# EasyEDA Pro project ax08_doc.eprj, schematic sequencer
Board Name: sequencer; Create Date: 2025-08-25; Page Name: sequencer; Project Name: ax08; Schematic Name: sequencer; Update Date: 2025-08-25; Company: EasyEDA.com; Page Size: A4; Version: V1.0
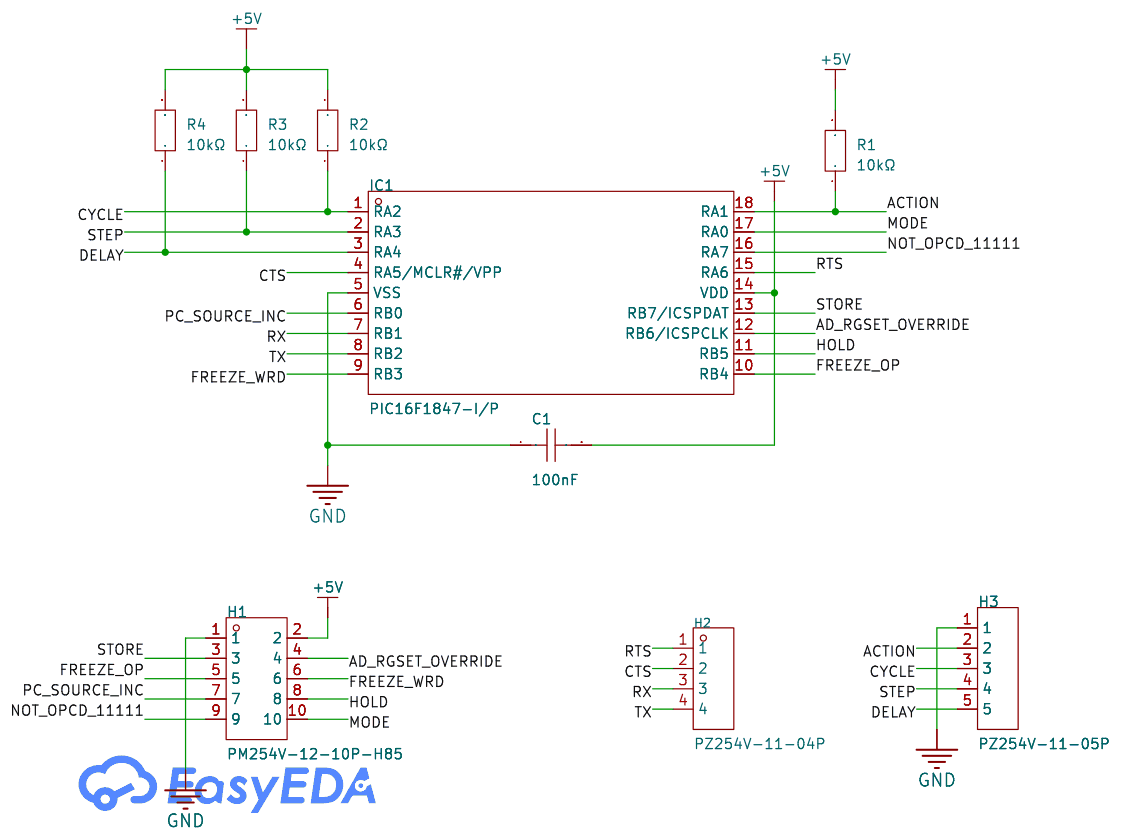
[diagram p2: schematic sheet]

## Parts
C1  100nF  [C0805]
H1  PM254V-12-10P-H85  [HDR-TH_10P-P2.54-V-F-R2-C5-S2.54]
H2  PZ254V-11-04P  [HDR-TH_4P-P2.54-V-M]
H3  PZ254V-11-05P  [HDR-TH_5P-P2.54-V-M]
IC1  PIC16F1847-I/P  [PDIP-18_L22.9-W6.4-P2.54-LS7.9-BL]
R1  10kΩ  [R0603]
R2  10kΩ  [R0603]
R3  10kΩ  [R0603]
R4  10kΩ  [R0603]

## Library data of the parts
C1 = CC0805KRX7R9BB104: Capacitance: Tolerance:±10% Tolerance:±10% Voltage Rated: Temperature Coefficient:; LCSC Part Name: 100nF ±10% 50V; Supplier Part: C49678; Manufacturer: YAGEO(国巨); Supplier Footprint: 0805; JLCPCB Part Class: Basic Part; Datasheet: https://atta.szlcsc.com/upload/public/pdf/source/20180224/C181747_15194369449651363981.pdf; Supplier: LCSC; Tolerance: ±10%
H1 = PM254V-12-10P-H85: LCSC Part Name: 间距:2.54mm 2x5P 直插; Supplier Part: C492399; Manufacturer: XFCN(兴飞); Supplier Footprint: 插件,P=2.54mm; JLCPCB Part Class: Extended Part; Datasheet: https://atta.szlcsc.com/upload/public/pdf/source/20200309/C492399_8C441E2934FBB604A89B37A68AA45ECF.pdf; Supplier: LCSC; Holes Structure: 2x5P; Pitch: 2.54mm; Row Spacing: 2.54mm; Mounting Type: Straight; Number of Rows: 双排; Number of Holes: 10P; Contact Material: Brass
H2 = PZ254V-11-04P: LCSC Part Name: 间距:2.54mm 1x4P 直插 方针; Supplier Part: C2691448; Manufacturer: XFCN(兴飞); Supplier Footprint: 插件,P=2.54mm; JLCPCB Part Class: Extended Part; Datasheet: https://atta.szlcsc.com/upload/public/pdf/source/20200309/C492403_F9F19131791D08044AD4F84F8E751A34.pdf; Supplier: LCSC; Pin Structure: 1x4P; Pitch: 2.54mm; Circluar Pins/Square Pins: Square Pins; Mounting Type: Straight; Number of Rows: Plugin; Number of Pins: 4P; Current Rating (Max): 3A; Voltage Rating (Max): 250V; Length of Mating Pin: 6mm; Insulation Height: 2.5mm; Length of End Connection Pin: 3mm; Operating Temperature Range: -40℃~+105℃; Color: Black
H3 = PZ254V-11-05P: LCSC Part Name: 1x5P 间距:2.54mm 方针 直插; Supplier Part: C492404; Manufacturer: XFCN(兴飞); Supplier Footprint: 插件,P=2.54mm; JLCPCB Part Class: Extended Part; Datasheet: https://atta.szlcsc.com/upload/public/pdf/source/20200309/C492404_E51533260F8710EFF5D4617281164C1D.pdf; Supplier: LCSC; Pin Structure: 1x5P; Pitch: 2.54mm; Circluar Pins/Square Pins: Policy; Mounting Type: Straight; Number of Rows: Single Row; Number of Pins: 5P; Length of Mating Pin: 6mm; Insulation Height: 2.5mm; Length of End Connection Pin: 3mm; Contact Material: Brass; Operating Temperature: -40℃~+105℃; Color: Black
IC1 = PIC16F1847-I/P: CPU Core:PIC Program Storage Size:16KB RAM Size:1KB GPIO Ports Number:15 Operating Voltage Range:1.8V~5.5V Operating Voltage Range:1.8V~5.5V CPU Maximum Speed:32MHz Program Memory Type:FLASH EEPROM:8KB Operating Temperature Range:-40℃~+85℃ Operating Tempe; Supplier Part: C646910; Manufacturer: MICROCHIP(美国微芯); Supplier Footprint: PDIP-18; JLCPCB Part Class: Extended Part; Datasheet: https://atta.szlcsc.com/upload/public/pdf/source/20200624/C624148_F79067E6D18DA6D6E37021FCD51102F9.pdf; Supplier: LCSC; CPU Core: PIC; Program Storage Size: 16KB; RAM Size: 1KB; GPIO Ports Number: 15; Operating Voltage Range: 1.8V~5.5V; CPU Maximum Speed: 32MHz; Program Memory Type: FLASH; EEPROM: 8KB; Operating Temperature Range: -40℃~+85℃; ADC (Bit): 10bit; Peripheral/Function: WDT；PWM; Watchdog: 有; Low-Voltage Detect: 有; Internal Oscillator: 有
R1-R4 = FRC0603F4702TS: LCSC Part Name: 47kΩ ±1% 100mW 厚膜电阻; Supplier Part: C2907042; Manufacturer: FOJAN(富捷); Supplier Footprint: 0603; JLCPCB Part Class: Extended Part; Datasheet: https://atta.szlcsc.com/upload/public/pdf/source/20211221/925EC7D7225764EE0046F22065062C87.pdf; Supplier: LCSC; Type: Thick Film Resistors; Tolerance: ±1%; Temperature Coefficient: ±100ppm/℃; Operating Temperature Range: -55℃~+155℃

## Nets
+5V: C1.2 H1.2 IC1.14(VDD) R1.2 R2.2 R3.2 R4.2
GND: C1.1 H1.1 H3.1 IC1.5(VSS)
ACTION: H3.2 IC1.18(RA1) R1.1
AD_RGSET_OVERRIDE: H1.4 IC1.12(RB6/ICSPCLK)
CTS: H2.2 IC1.4(RA5/MCLR#/VPP)
CYCLE: H3.3 IC1.1(RA2) R2.1
DELAY: H3.5 IC1.3(RA4) R4.1
FREEZE_OP: H1.5 IC1.10(RB4)
FREEZE_WRD: H1.6 IC1.9(RB3)
HOLD: H1.8 IC1.11(RB5)
MODE: H1.10 IC1.17(RA0)
NOT_OPCD_11111: H1.9 IC1.16(RA7)
PC_SOURCE_INC: H1.7 IC1.6(RB0)
RTS: H2.1 IC1.15(RA6)
RX: H2.3 IC1.7(RB1)
STEP: H3.4 IC1.2(RA3) R3.1
STORE: H1.3 IC1.13(RB7/ICSPDAT)
TX: H2.4 IC1.8(RB2)
